# Altium schematic sheet RAK811Reference design.SchDoc
size A4
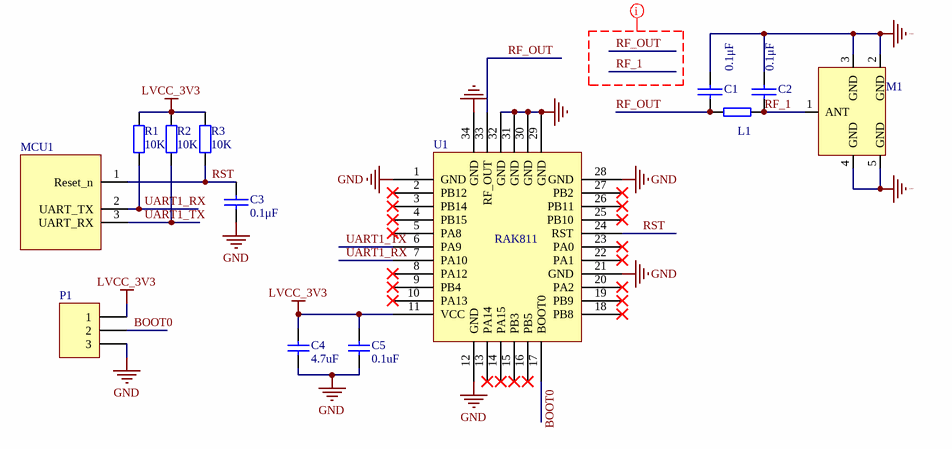
[diagram p0: RAK811Reference design.SchDoc]

## Parts
C1  0.1μF  [0603AC]
C2  0.1μF  [0603AC]
C3  0.1μF  [0603AC]
C4  value 4.7uF  [0603AC]  (hidden comment: Cap)
C5  value 0.1uF  [0603AC]  (hidden comment: Cap)
L1  (no value)  [0603AR]
M1  MCX-KWE  [SMA-KWE天线底座]  (value not drawn)
MCU1  MCU  [HDR1X2]  (value not drawn)
P1  (no value)  [HDR1X3]
R1  10K  [0603AR]
R2  10K  [0603AR]
R3  10K  [0603AR]
U1  RAK811  [LORA]

## Nets
GND: C1.1 C2.1 C3.1 C4.1 C5.1 M1.2(GND) M1.3(GND) M1.4(GND) M1.5(GND) P1.3 U1.1(GND) U1.12(GND) U1.21(GND) U1.28(GND) U1.29(GND) U1.30(GND) U1.31(GND) U1.32(GND) U1.34(GND)
LVCC_3V3: C4.2 C5.2 P1.1 R1.2 R2.2 R3.2 U1.11(VCC)
BOOT0: P1.2 U1.17(BOOT0)
RF_1: C2.2 L1.2 M1.1(ANT)
RF_OUT: C1.2 L1.1 U1.33(RF_OUT)
RST: C3.2 MCU1.1(Reset_n) R3.1 U1.24(RST)
UART1_RX: MCU1.2(UART_TX) R1.1 U1.7(PA10)
UART1_TX: MCU1.3(UART_RX) R2.1 U1.6(PA9)

Not connected (* = marked no-connect by the designer): U1 2(PB12)* 3(PB14)* 4(PB15)* 5(PA8)* 8(PA12)* 9(PB4)* 10(PA13)* 13(PA14)* 14(PA15)* 15(PB3)* 16(PB5)* 18(PB8)* 19(PB9)* 20(PA2)* 22(PA1)* 23(PA0)* 25(PB10)* 26(PB11)* 27(PB2)*

## Layout directives
net class RF: RF_1, RF_OUT

## Library data of the parts
C1-C3 = CAP: Capacitor
C4 C5 = Cap: Capacitor; Published: 8-Jun-2000; LatestRevisionDate: 17-Jul-2002; LatestRevisionNote: Re-released for DXP Platform.; PackageReference: RAD-0.3; Publisher: Altium Limited
L1 = RES
MCU1 = MCU: Header, 2-Pin; LatestRevisionDate: 17-Jul-2002; LatestRevisionNote: Re-released for DXP Platform.; Publisher: Altium Limited
P1 = Header 3: Header, 3-Pin; LatestRevisionDate: 17-Jul-2002; LatestRevisionNote: Re-released for DXP Platform.; Publisher: Altium Limited
R1-R3 = Res2: Resistor; Published: 8-Jun-2000; LatestRevisionDate: 17-Jul-2002; LatestRevisionNote: Re-released for DXP Platform.; PackageReference: AXIAL-0.4; Publisher: Altium Limited; Value: 10K
U1 = LORA Model